# Altium project PMOD_RS485.PrjPcb
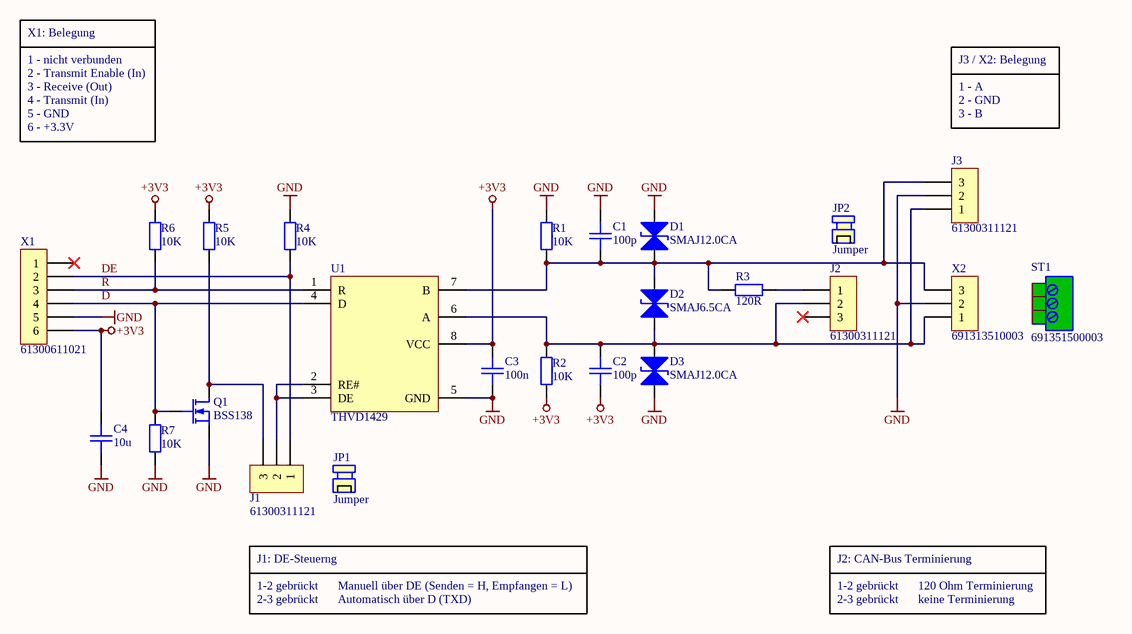
[diagram p0: PMOD_RS485.SchDoc]
P_SchStatus: Freigegeben; P_SchNumber: tbd; P_SchIndex: 0; P_SchDrawnBy: S.Schandl; P_SchDrawn: 14.05.2020; P_SchCheckedBy: P. Sikasa; P_SchChecked: 16.05.2020; P_ProjectName: PMOD RS485; P_PcbStatus: Freigegeben; P_PcbNumber: tbd; P_PcbIndex: 0; P_PcbDrawnBy: S.Schandl; P_PcbDrawn: 18.05.2020; P_PcbCheckedBy: P. Sikasa; P_PcbChecked: 20.05.2020
1 sheet, 24 parts. Net scope: global (net labels, ports and power ports of the same name join across sheets).
Board file: PMOD_RS485.PcbDoc

## Sheet PMOD_RS485.SchDoc: RS485 Schnittstellen Treiber
size A4; SheetNumber: 1; SheetTotal: 1

### Parts
C1  100p  [0805-C]
C2  100p  [0805-C]
C3  100n  [0805-C]
C4  10u  [0805-C]
D1  SMAJ12.0CA  [SMA-BIDIRECTIONAL]
D2  SMAJ6.5CA  [SMA-BIDIRECTIONAL]
D3  SMAJ12.0CA  [SMA-BIDIRECTIONAL]
J1  61300311121  [WE-61300311121]
J2  61300311121  [WE-61300311121]
J3  61300311121  [WE-61300311121]
JP1  Jumper  (mechanical)
JP2  Jumper  (mechanical)
Q1  BSS138  [SOT23-3]
R1  10K  [0805-R]
R2  10K  [0805-R]
R3  120R  [1206-R]
R4  10K  [0805-R]
R5  10K  [0805-R]
R6  10K  [0805-R]
R7  10K  [0805-R]
ST1  691351500003  (mechanical)
U1  THVD1429  [SOIC-8]
X1  61300611021  [WE-61302021121]
X2  691313510003  [WE-691313510003]

### Nets
+3V3: C2.2 C3.1 C4.2 R2.2 R5.2 R6.1 U1.8(VCC) X1.6
GND: C1.1 C3.2 C4.1 D1.1(A1) D3.2(A2) J3.2 Q1.2(Source) R1.1 R4.2 R7.1 U1.5(GND) X1.5 X2.2
D: Q1.1(Gate) R7.2 U1.4(D) X1.4
DE: J1.1 R4.1 X1.2
R: R6.2 U1.1(R) X1.3
NetC1_2: C1.2 D1.2(A2) D2.1(A1) J3.3 R1.2 R3.1 U1.7(B) X2.3
NetC2_1: C2.1 D2.2(A2) D3.1(A1) J2.2 J3.1 R2.1 U1.6(A) X2.1
NetJ1_2: J1.2 U1.2(RE#) U1.3(DE)
NetJ1_3: J1.3 Q1.3(Drain) R5.1
NetJ2_1: J2.1 R3.2

Not connected (* = marked no-connect by the designer): J2 3*; X1 1*

### Notes on the sheet
- X1: Belegung
- 1 - nicht verbunden
- 2 - Transmit Enable (In)
- 3 - Receive (Out)
- J3 / X2: Belegung
- 1 - A
- 4 - Transmit (In)
- 5 - GND
- 6 - +3.3V
- 2 - GND
- 3 - B
- J1: DE-Steuerng
- J2: CAN-Bus Terminierung
- 1-2 gebrückt
- 2-3 gebrückt
- Manuell über DE (Senden = H, Empfangen = L)
- Automatisch über D (TXD)
- 120 Ohm Terminierung
- keine Terminierung
- Gezeichnet von
- am
- Projekt
- ibs
- Geprüft von
- Nummer
- Titel
- Variante
- Revision
- Grösse
- Status
- Datei
- Blatt
- Blätter
- A4
- Weitergabe, sowie Vervielfältigung dieser Unterlage, Verwertung und Mitteilung ihres Inhaltes nicht gestattet, soweit nicht ausdrücklich schriftlich zugestanden. Alle Rechte vorbehalten.
- IBS-Systemtechnik
  Wettersteinstrasse 14
  D-82481 Mittenwald

### Library data of the parts
C1 C2 = Capacitor 100p 0805: CAP CER 100PF 250V C0G/NP0 0805; Manufacturer PartNo: GRM21A5C2E101FW01D; Manufacturer: Murata Electronics; Supplier 1 (Info): Digi-Key; Supplier 1 PartNo (Info): 490-GRM21A5C2E101FW01DCT-ND
C3 = Capacitor 100n 0805: CAP CER 0.1UF 50V X8R 0805; Manufacturer PartNo: GCM21BR91H104KA37L; Manufacturer: Murata Electronics; Supplier 1 (Info): Digi-Key; Supplier 1 PartNo (Info): 490-11165-1-ND
C4 = Capacitor 10u 0805: CAP CER 10UF 16V X5R 0805; Manufacturer PartNo: EMK212BBJ106KGHT; Manufacturer: Taiyo Yuden; Supplier 1 (Info): Digi-Key; Supplier 1 PartNo (Info): 587-3320-1-ND
D1 D3 = Diode TVS SMAJ12.0CA: TVS DIODE 12V 19.9V DO214AC; Manufacturer PartNo: SMAJ12CA-TP; Manufacturer: Micro Commercial Co; Supplier 1 (Info): Digi-Key; Supplier 1 PartNo (Info): SMAJ12CA-TPMSCT-ND
D2 = Diode TVS SMAJ6.5CA: TVS DIODE 6.5V 11.2V DO214AC; Manufacturer PartNo: SMAJ6.5CA-TP; Manufacturer: Micro Commercial Co; Supplier 1 (Info): Digi-Key; Supplier 1 PartNo (Info): SMAJ6.5CA-TPMSCT-ND
J1-J3 = WE 61300311121: CONN HEADER VERT 3POS 2.54MM; Manufacturer: Würth Elektronik; Manufacturer PartNo: 61300311121; Supplier 1 (Info): Digi-Key; Supplier 1 PartNo (Info): 732-5316-ND
JP1 JP2 = Jumper: JUMPER W/TEST PNT 1X2PINS 2.54MM; Manufacturer: Würth Elektronik; Manufacturer PartNo: 60900213421; Supplier 1 (Info): Digi-Key; Supplier 1 PartNo (Info): 732-2678-ND
Q1 = Transistor MOSFET N Channel: MOSFET N-CH 50V 200MA SOT-23; Manufacturer: ON Semiconductor; Manufacturer PartNo: BSS138LT3G; Supplier 1 PartNo (Info): BSS138LT3GOSCT-ND; Supplier 1 (Info): Digi-Key
R1 R2 R4-R7 = Resistor 10K 0805: RES SMD 10K OHM 1% 1/8W 0805; Manufacturer: Yageo; Manufacturer PartNo: RC0805FR-0710KL; Supplier 1 (Info): Digi-Key; Supplier 1 PartNo (Info): 311-10.0KCRCT-ND
R3 = Resistor 120R 1206: RES SMD 120 OHM 1% 1/4W 1206; Manufacturer: Yageo; Manufacturer PartNo: RC1206FR-07120RL; Supplier 1 (Info): Digi-Key; Supplier 1 PartNo (Info): 311-120FRCT-ND
ST1 = Plug WE 691351500003: TERM BLOCK PLUG 3POS 5.08MM; Manufacturer: Würth Elektronik; Manufacturer PartNo: 691351500003; Supplier 1 (Info): Digi-Key; Supplier 1 PartNo (Info): 732-2041-ND
U1 = THVD1429 SOIC8: IC TRANSCEIVER HALF 1/1 8SOIC; Manufacturer: Texas Instruments; Manufacturer PartNo: THVD1429DR; Supplier 1 (Info): Digi-Key; Supplier 1 PartNo (Info): 296-THVD1429DRCT-ND
X1 = PMOD Plug 6X1: CONN HEADER R/A 6POS 2.54MM; Manufacturer: Würth Elektronik; Manufacturer PartNo: 61300611021; Supplier 1 (Info): Digi-Key; Supplier 1 PartNo (Info): 732-5339-ND
X2 = WE 691313510003: TERM BLOCK HDR 3POS 90DEG 5.08MM; Manufacturer: Würth Elektronik; Manufacturer PartNo: 691313510003; Supplier 1 (Info): Digi-Key; Supplier 1 PartNo (Info): 732-2071-ND